# Altium schematic sheet MYBOARD_04-Other Function.SchDoc
size B
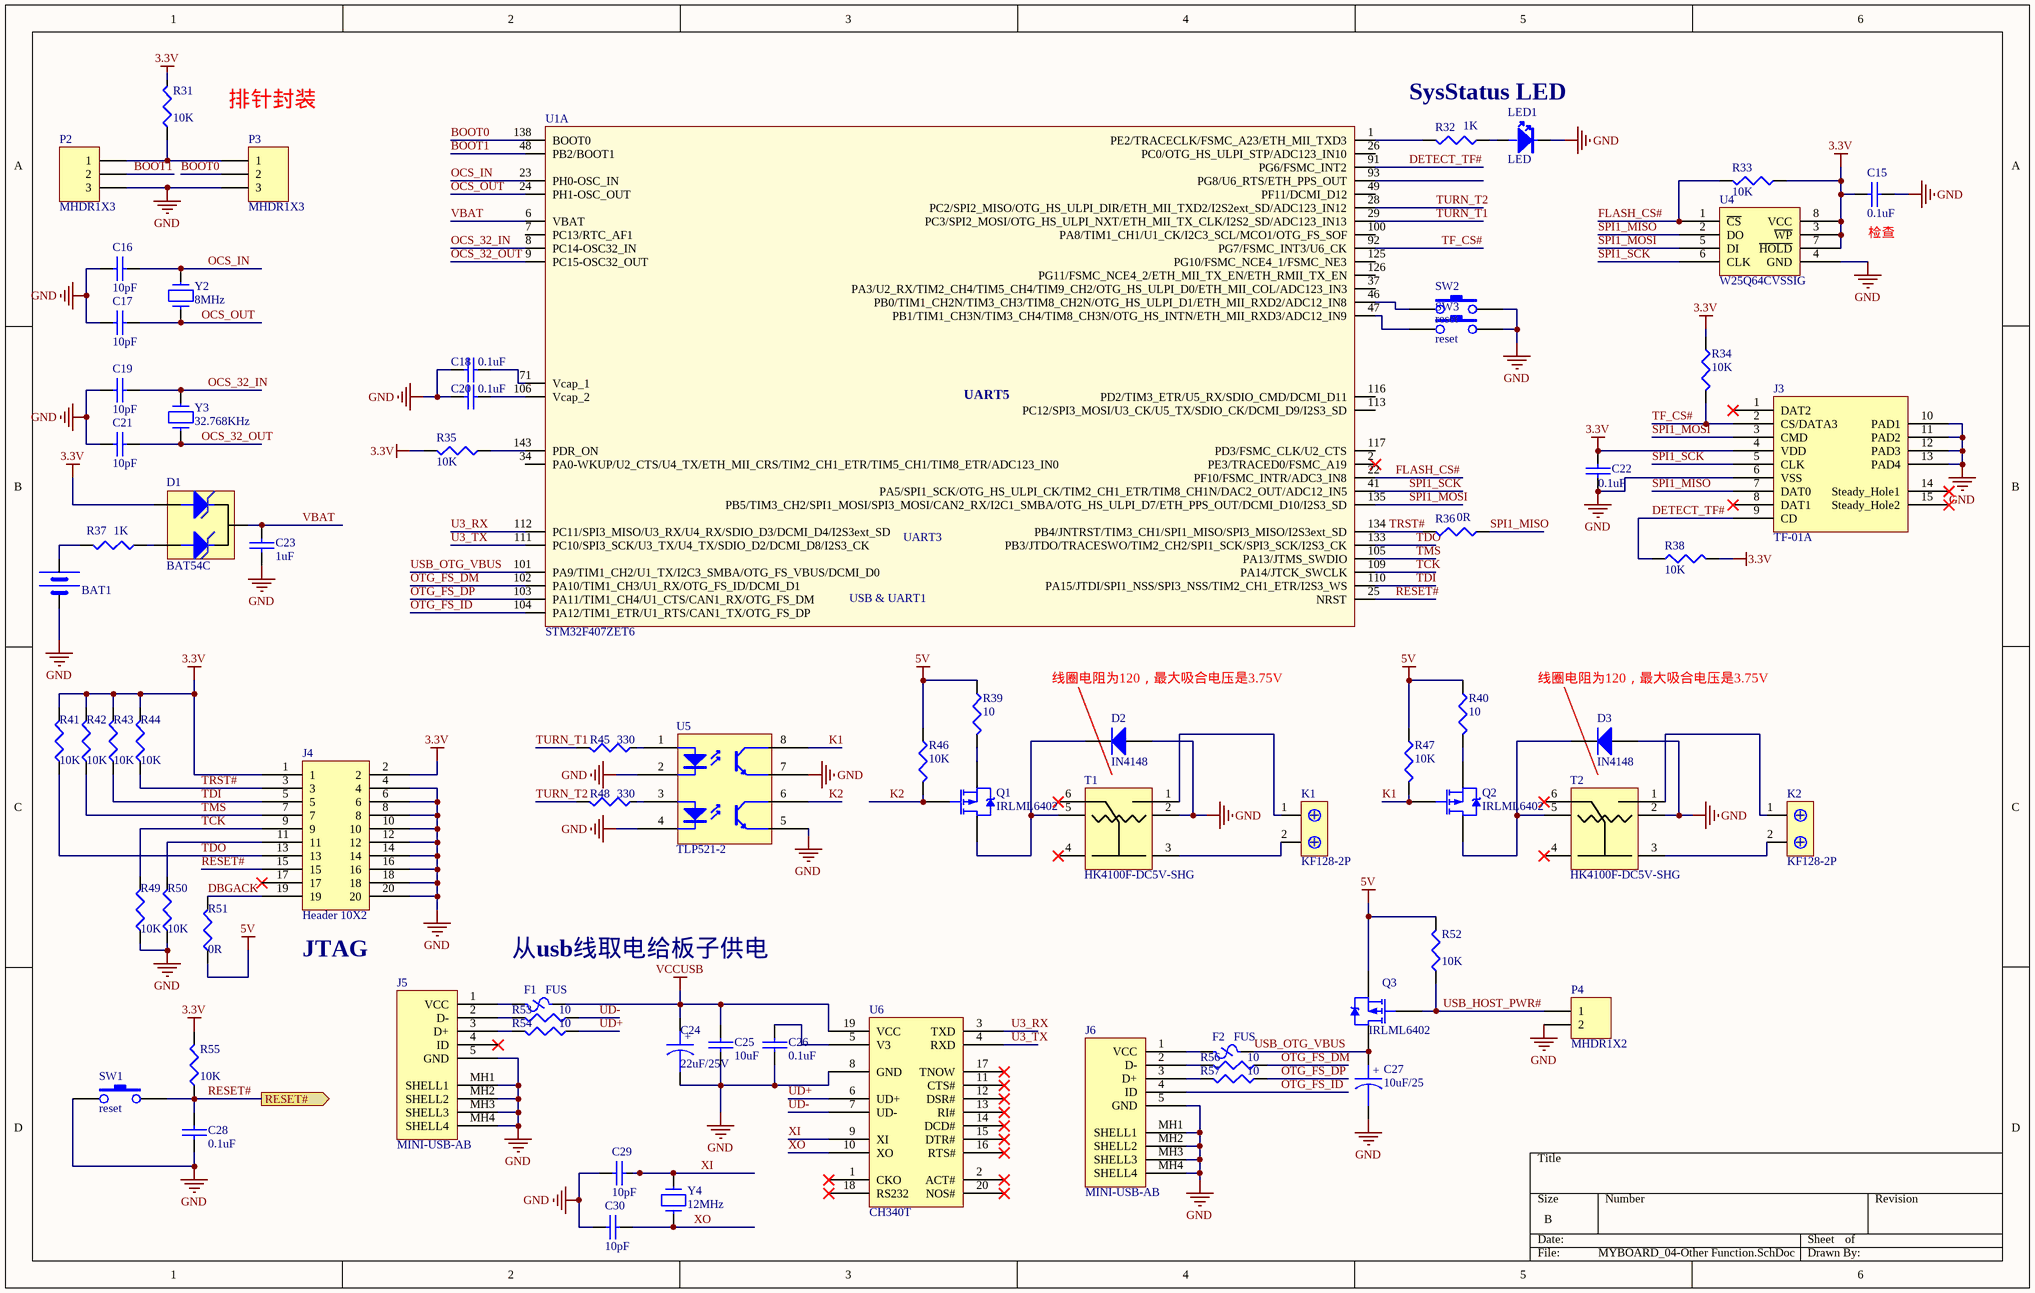
[diagram p0: MYBOARD_04-Other Function.SchDoc]

## Parts
BAT1  BATT  [BC501SM]  (value not drawn)
C15  0.1uF  [C0603_DWS]
C16  10pF  [C0603_DWS]
C17  10pF  [C0603_DWS]
C18  0.1uF  [C0603_DWS]
C19  10pF  [C0603_DWS]
C20  0.1uF  [C0603_DWS]
C21  10pF  [C0603_DWS]
C22  0.1uF  [C0603_DWS]
C23  1uF  [C0603_DWS]
C24  22uF/25V  [CAPAE7053X56M]
C25  10uF  [C0603_DWS]
C26  0.1uF  [C0603_DWS]
C27  10uF/25  [CAPAE7053X56M]
C28  0.1uF  [C0603_DWS]
C29  10pF  [C0603_DWS]
C30  10pF  [C0603_DWS]
D1  BAT54C  [BAT54C]
D2  IN4148  [1N4148WS]
D3  IN4148  [1N4148WS]
F1  FUS  [1206]
F2  FUS  [1206]
J3  TF-01A  [TF-01A]
J4  Header 10X2  [HDR2X10H]
J5  MINI-USB-AB  [MINI-B]
J6  MINI-USB-AB  [MINI-B]
K1  KF128-2P  [KF128-2P]
K2  KF128-2P  [KF128-2P]
LED1  LED  [LED-0603]
P2  MHDR1X3  [HN1X3]
P3  MHDR1X3  [HN1X3]
P4  MHDR1X2  [JP1]
Q1  IRLML6402  [SOTFL95P264X112-3N]
Q2  IRLML6402  [SOTFL95P264X112-3N]
Q3  IRLML6402  [SOTFL95P264X112-3N]
R31  value 10K  [R0603_5MIL_DWS]  (hidden comment: Res3)
R32  value 1K  [R0603_5MIL_DWS]  (hidden comment: Res3)
R33  value 10K  [R0603_5MIL_DWS]  (hidden comment: Res3)
R34  value 10K  [R0603_5MIL_DWS]  (hidden comment: Res3)
R35  value 10K  [R0603_5MIL_DWS]  (hidden comment: Res3)
R36  value 0R  [R0603_5MIL_DWS]  (hidden comment: Res3)
R37  value 1K  [R0603_5MIL_DWS]  (hidden comment: Res3)
R38  value 10K  [R0603_5MIL_DWS]  (hidden comment: Res3)
R39  value 10  [R0603_5MIL_DWS]  (hidden comment: Res3)
R40  value 10  [R0603_5MIL_DWS]  (hidden comment: Res3)
R41  value 10K  [R0603_5MIL_DWS]  (hidden comment: Res3)
R42  value 10K  [R0603_5MIL_DWS]  (hidden comment: Res3)
R43  value 10K  [R0603_5MIL_DWS]  (hidden comment: Res3)
R44  value 10K  [R0603_5MIL_DWS]  (hidden comment: Res3)
R45  value 330  [R0603_5MIL_DWS]  (hidden comment: Res3)
R46  value 10K  [R0603_5MIL_DWS]  (hidden comment: Res3)
R47  value 10K  [R0603_5MIL_DWS]  (hidden comment: Res3)
R48  value 330  [R0603_5MIL_DWS]  (hidden comment: Res3)
R49  value 10K  [R0603_5MIL_DWS]  (hidden comment: Res3)
R50  value 10K  [R0603_5MIL_DWS]  (hidden comment: Res3)
R51  value 0R  [R0603_5MIL_DWS]  (hidden comment: Res3)
R52  value 10K  [R0603_5MIL_DWS]  (hidden comment: Res3)
R53  value 10  [R0603_5MIL_DWS]  (hidden comment: Res3)
R54  value 10  [R0603_5MIL_DWS]  (hidden comment: Res3)
R55  value 10K  [R0603_5MIL_DWS]  (hidden comment: Res3)
R56  value 10  [R0603_5MIL_DWS]  (hidden comment: Res3)
R57  value 10  [R0603_5MIL_DWS]  (hidden comment: Res3)
SW1  reset  [SW-TAKT_6X3.5_SMD]
SW2  reset  [SW-TAKT_6X3.5_SMD]
SW3  reset  [SW-TAKT_6X3.5_SMD]
T1  HK4100F-DC5V-SHG  [HK4100F]
T2  HK4100F-DC5V-SHG  [HK4100F]
U1  STM32F407ZET6  [LQFP144]  (part A of 3)
U4  W25Q64CVSSIG  [SOIC-8]
U5  TLP521-2  [DIP-8]
U6  CH340T  [SSOP-20]
Y2  8MHz  [CRYSTAL22.1184_3*5 - duplicate]
Y3  32.768KHz  [CRYSTAL22.1184_3*5 - duplicate]
Y4  12MHz  [HC49/SMD2_THIN]

## Ports
RESET#

## Nets
3.3V: C15.1 C22.2 D1.1 J3.4(VDD) J4.1 J4.2 R31.2 R33.1 R34.1 R35.2 R38.2 R41.2 R42.2 R43.2 R44.2 R55.2 U4.3(~{WP}) U4.7(~{HOLD}) U4.8(VCC)
5V: Q3.2(S) R39.1 R40.1 R46.1 R47.1 R51.1 R52.2
GND: BAT1.2(GND) C15.2 C16.1 C17.1 C18.1 C19.1 C20.1 C21.1 C22.1 C23.2 C24.2 C25.2 C26.2 C27.2 C28.2 C29.1 C30.1 D2.2(A) D3.2(A) J3.6(VSS) J3.10(PAD1) J3.11(PAD2) J3.12(PAD3) J3.13(PAD4) J4.4 J4.6 J4.8 J4.10 J4.12 J4.14 J4.16 J4.18 J4.20 J5.5(GND) J5.MH1(SHELL1) J5.MH2(SHELL2) J5.MH3(SHELL3) J5.MH4(SHELL4) J6.5(GND) J6.MH1(SHELL1) J6.MH2(SHELL2) J6.MH3(SHELL3) J6.MH4(SHELL4) LED1.C P2.3 P3.3 P4.2 R49.1 R50.1 SW1.P$1 SW2.P$2 SW3.P$2 T1.2(COIL1) T2.2(COIL1) U4.4(GND) U5.2(K) U5.4(K) U5.5(E) U5.7(E) U6.8(GND)
VCCUSB: C24.1 C25.1 F1.2 U6.19(VCC)
BOOT0: P3.2 U1.138(BOOT0)
BOOT1: P2.2 U1.48(PB2/BOOT1)
DBGACK: J4.19 R51.2
DETECT_TF#: J3.9(CD) R38.1 U1.91(PG6/FSMC_INT2)
FLASH_CS#: R33.2 U1.22(PF10/FSMC_INTR/ADC3_IN8) U4.1(~{CS})
K1: Q2.1(G) R47.2 U5.8(C)
K2: Q1.1(G) R46.2 U5.6(C)
OCS_32_IN: C19.2 U1.8(PC14-OSC32_IN) Y3.2
OCS_32_OUT: C21.2 U1.9(PC15-OSC32_OUT) Y3.1
OCS_IN: C16.2 U1.23(PH0-OSC_IN) Y2.2
OCS_OUT: C17.2 U1.24(PH1-OSC_OUT) Y2.1
OTG_FS_DM: R56.1 U1.102(PA10/TIM1_CH3/U1_RX/OTG_FS_ID/DCMI_D1)
OTG_FS_DP: R57.1 U1.103(PA11/TIM1_CH4/U1_CTS/CAN1_RX/OTG_FS_DM)
OTG_FS_ID: J6.4(ID) U1.104(PA12/TIM1_ETR/U1_RTS/CAN1_TX/OTG_FS_DP)
RESET#: C28.1 J4.15 R55.1 SW1.P$2 U1.25(NRST) ; port RESET#
SPI1_MISO: J3.7(DAT0) R36.1 U4.2(DO)
SPI1_MOSI: J3.3(CMD) U1.135(PB5/TIM3_CH2/SPI1_MOSI/SPI3_MOSI/CAN2_RX/I2C1_SMBA/OTG_HS_ULPI_D7/ETH_PPS_OUT/DCMI_D10/I2S3_SD) U4.5(DI)
SPI1_SCK: J3.5(CLK) U1.41(PA5/SPI1_SCK/OTG_HS_ULPI_CK/TIM2_CH1_ETR/TIM8_CH1N/DAC2_OUT/ADC12_IN5) U4.6(CLK)
TCK: J4.9 R49.2 U1.109(PA14/JTCK_SWCLK)
TDI: J4.5 R43.1 U1.110(PA15/JTDI/SPI1_NSS/SPI3_NSS/TIM2_CH1_ETR/I2S3_WS)
TDO: J4.13 R41.1 U1.133(PB3/JTDO/TRACESWO/TIM2_CH2/SPI1_SCK/SPI3_SCK/I2S3_CK)
TF_CS#: J3.2(CS/DATA3) R34.2 U1.92(PG7/FSMC_INT3/U6_CK)
TMS: J4.7 R42.1 U1.105(PA13/JTMS_SWDIO)
TRST#: J4.3 R36.2 R44.1 U1.134(PB4/JNTRST/TIM3_CH1/SPI1_MISO/SPI3_MISO/I2S3ext_SD)
TURN_T1: R45.2 U1.29(PC3/SPI2_MOSI/OTG_HS_ULPI_NXT/ETH_MII_TX_CLK/I2S2_SD/ADC123_IN13)
TURN_T2: R48.2 U1.28(PC2/SPI2_MISO/OTG_HS_ULPI_DIR/ETH_MII_TXD2/I2S2ext_SD/ADC123_IN12)
U3_RX: U1.112(PC11/SPI3_MISO/U3_RX/U4_RX/SDIO_D3/DCMI_D4/I2S3ext_SD) U6.3(TXD)
U3_TX: U1.111(PC10/SPI3_SCK/U3_TX/U4_TX/SDIO_D2/DCMI_D8/I2S3_CK) U6.4(RXD)
UD+: R54.1 U6.6(UD+)
UD-: R53.1 U6.7(UD-)
USB_HOST_PWR#: P4.1 Q3.1(G) R52.1
USB_OTG_VBUS: C27.1 F2.2 Q3.3(D) U1.101(PA9/TIM1_CH2/U1_TX/I2C3_SMBA/OTG_FS_VBUS/DCMI_D0)
VBAT: C23.1 D1.3 U1.6(VBAT)
XI: C29.2 U6.9(XI) Y4.2
XO: C30.2 U6.10(XO) Y4.1
NetBAT1_1: BAT1.1(VCC) R37.2
NetC18_2: C18.2 U1.71(Vcap_1)
NetC20_2: C20.2 U1.106(Vcap_2)
NetC26_1: C26.1 U6.5(V3)
NetD1_2: D1.2 R37.1
NetD2_1: D2.1(K) Q1.3(D) T1.5(COIL2)
NetD3_1: D3.1(K) Q2.3(D) T2.5(COIL2)
NetF1_1: F1.1 J5.1(VCC)
NetF2_1: F2.1 J6.1(VCC)
NetJ4_11: J4.11 R50.2
NetJ5_2: J5.2(D-) R53.2
NetJ5_3: J5.3(D+) R54.2
NetJ6_2: J6.2(D-) R56.2
NetJ6_3: J6.3(D+) R57.2
NetK1_1: K1.1 T1.1(NO)
NetK1_2: K1.2 T1.3(COM)
NetK2_1: K2.1 T2.1(NO)
NetK2_2: K2.2 T2.3(COM)
NetLED1_A: LED1.A R32.1
NetP2_1: P2.1 P3.1 R31.1
NetQ1_2: Q1.2(S) R39.2
NetQ2_2: Q2.2(S) R40.2
NetR32_2: R32.2 U1.1(PE2/TRACECLK/FSMC_A23/ETH_MII_TXD3)
NetR35_1: R35.1 U1.143(PDR_ON)
NetR45_1: R45.1 U5.1(A)
NetR48_1: R48.1 U5.3(A)
NetSW2_P$1: SW2.P$1 U1.46(PB0/TIM1_CH2N/TIM3_CH3/TIM8_CH2N/OTG_HS_ULPI_D1/ETH_MII_RXD2/ADC12_IN8)
NetSW3_P$1: SW3.P$1 U1.47(PB1/TIM1_CH3N/TIM3_CH4/TIM8_CH3N/OTG_HS_INTN/ETH_MII_RXD3/ADC12_IN9)

Not connected (* = marked no-connect by the designer): J3 1(DAT2)* 8(DAT1)* 14(Steady_Hole1)* 15(Steady_Hole2)*; J4 17*; J5 4(ID)*; T1 4(COM)* 6(NC)*; T2 4(COM)* 6(NC)*; U1 2(PE3/TRACED0/FSMC_A19)* 7(PC13/RTC_AF1) 26(PC0/OTG_HS_ULPI_STP/ADC123_IN10) 34(PA0-WKUP/U2_CTS/U4_TX/ETH_MII_CRS/TIM2_CH1_ETR/TIM5_CH1/TIM8_ETR/ADC123_IN0) 37(PA3/U2_RX/TIM2_CH4/TIM5_CH4/TIM9_CH2/OTG_HS_ULPI_D0/ETH_MII_COL/ADC123_IN3) 49(PF11/DCMI_D12) 93(PG8/U6_RTS/ETH_PPS_OUT) 100(PA8/TIM1_CH1/U1_CK/I2C3_SCL/MCO1/OTG_FS_SOF) 113(PC12/SPI3_MOSI/U3_CK/U5_TX/SDIO_CK/DCMI_D9/I2S3_SD) 116(PD2/TIM3_ETR/U5_RX/SDIO_CMD/DCMI_D11) 117(PD3/FSMC_CLK/U2_CTS) 125(PG10/FSMC_NCE4_1/FSMC_NE3) 126(PG11/FSMC_NCE4_2/ETH_MII_TX_EN/ETH_RMII_TX_EN); U6 1(CKO)* 2(ACT#)* 11(CTS#)* 12(DSR#)* 13(RI#)* 14(DCD#)* 15(DTR#)* 16(RTS#)* 17(TNOW)* 18(RS232)* 20(NOS#)*

## Notes on the sheet
- SysStatus LED
- 排针封装
- (near C15) 检查
- 线圈电阻为120，最大吸合电压是3.75V
- (near J4) JTAG
- 从usb线取电给板子供电
- (in symbol CAPACITOR POL) +
- (in symbol EEE1EA100SR) +
- (in symbol STM32F407ZET6, part A) UART5; UART3; USB & UART1

## Library data of the parts
BAT1 = BAT
C15-C23 C25 C26 C28-C30 = CAP: Capacitor
C24 = CAPACITOR POL: Capacitor
C27 = EEE1EA100SR: Aluminum Electrolytic Capacitor SMD  Footprint:SizeCode_C; Manufacturer: Panasonic; Manufacturer Part Number: EEE1EA100SR
D1 = BAT54C: Diode
D2 D3 = Diode 1N914: High Conductance Fast Diode; Published: 8-Jun-2000; LatestRevisionDate: 17-Jul-2002; LatestRevisionNote: Re-released for DXP Platform.; DatasheetVersion: 1997; PackageReference: DO-35; Publisher: Altium Limited; PackageDescription: Diode, Axial; Body 3.8 x 1.9 mm (LxDia. max), Lead Dia. 0.53 mm (max); Code_JEDEC: DO-204-AH; ComponentLink1Description: Manufacturer Link; ComponentLink1URL: http://www.fairchildsemi.com/; ComponentLink2Description: Datasheet; ComponentLink2URL: http://www.fairchildsemi.com/ds/1N%2F1N4448.pdf
J3 = TF-01A: TF card socket,9pin,minisd socket,mirco sd socket,
J4 = Header 10X2: Header, 10-Pin, Dual row
J5 J6 = MINI-USB-AB: MINI USB AB 5pin SMT
K1 K2 = KF128-2P: pitch 5mm,blue, 2 pin,length 10mm
P2 P3 = MHDR1X3: Header, 3-Pin; LatestRevisionDate: 17-Jul-2002; LatestRevisionNote: Re-released for DXP Platform.; Publisher: Altium Limited
P4 = MHDR1X2: Header, 2-Pin; LatestRevisionDate: 17-Jul-2002; LatestRevisionNote: Re-released for DXP Platform.; Publisher: Altium Limited
Q1-Q3 = IRLML6401: HEXFET Power MOSFET; Published: 17-Sep-2003; DatasheetVersion: 2-Jul-2001; PackageVersion: Jul-2001; PackageReference: Micro3; Publisher: Altium Limited; PackageDescription: 3-Pin SOT-23 Package 0.95 mm Pitch, 2.3 mm Lead Span; ComponentLink1Description: Manufacturer Link; ComponentLink1URL: http://www.irf.com/; ComponentLink2Description: Datasheet; ComponentLink2URL: http://www.irf.com/product-info/datasheets/data/IRLML6401.pdf
R31-R57 = Res3: Resistor; Published: 8-Jun-2000; LatestRevisionDate: 29-May-2009; LatestRevisionNote: IPC-7351 Footprint Added.; PackageReference: J1-0603; Publisher: Altium Limited; PackageDescription: Chip Resistor
SW1-SW3 = SW-PB: 贴片按键
T1 T2 = HK4100F
U4 = W25Q64CVSSIG: 64M Bits,SOIC-8,FLASH
Y2-Y4 = CRYSTAL: 无源晶振